# Altium project smoothieboard-alt.PrjPcb (part 1 of 4)
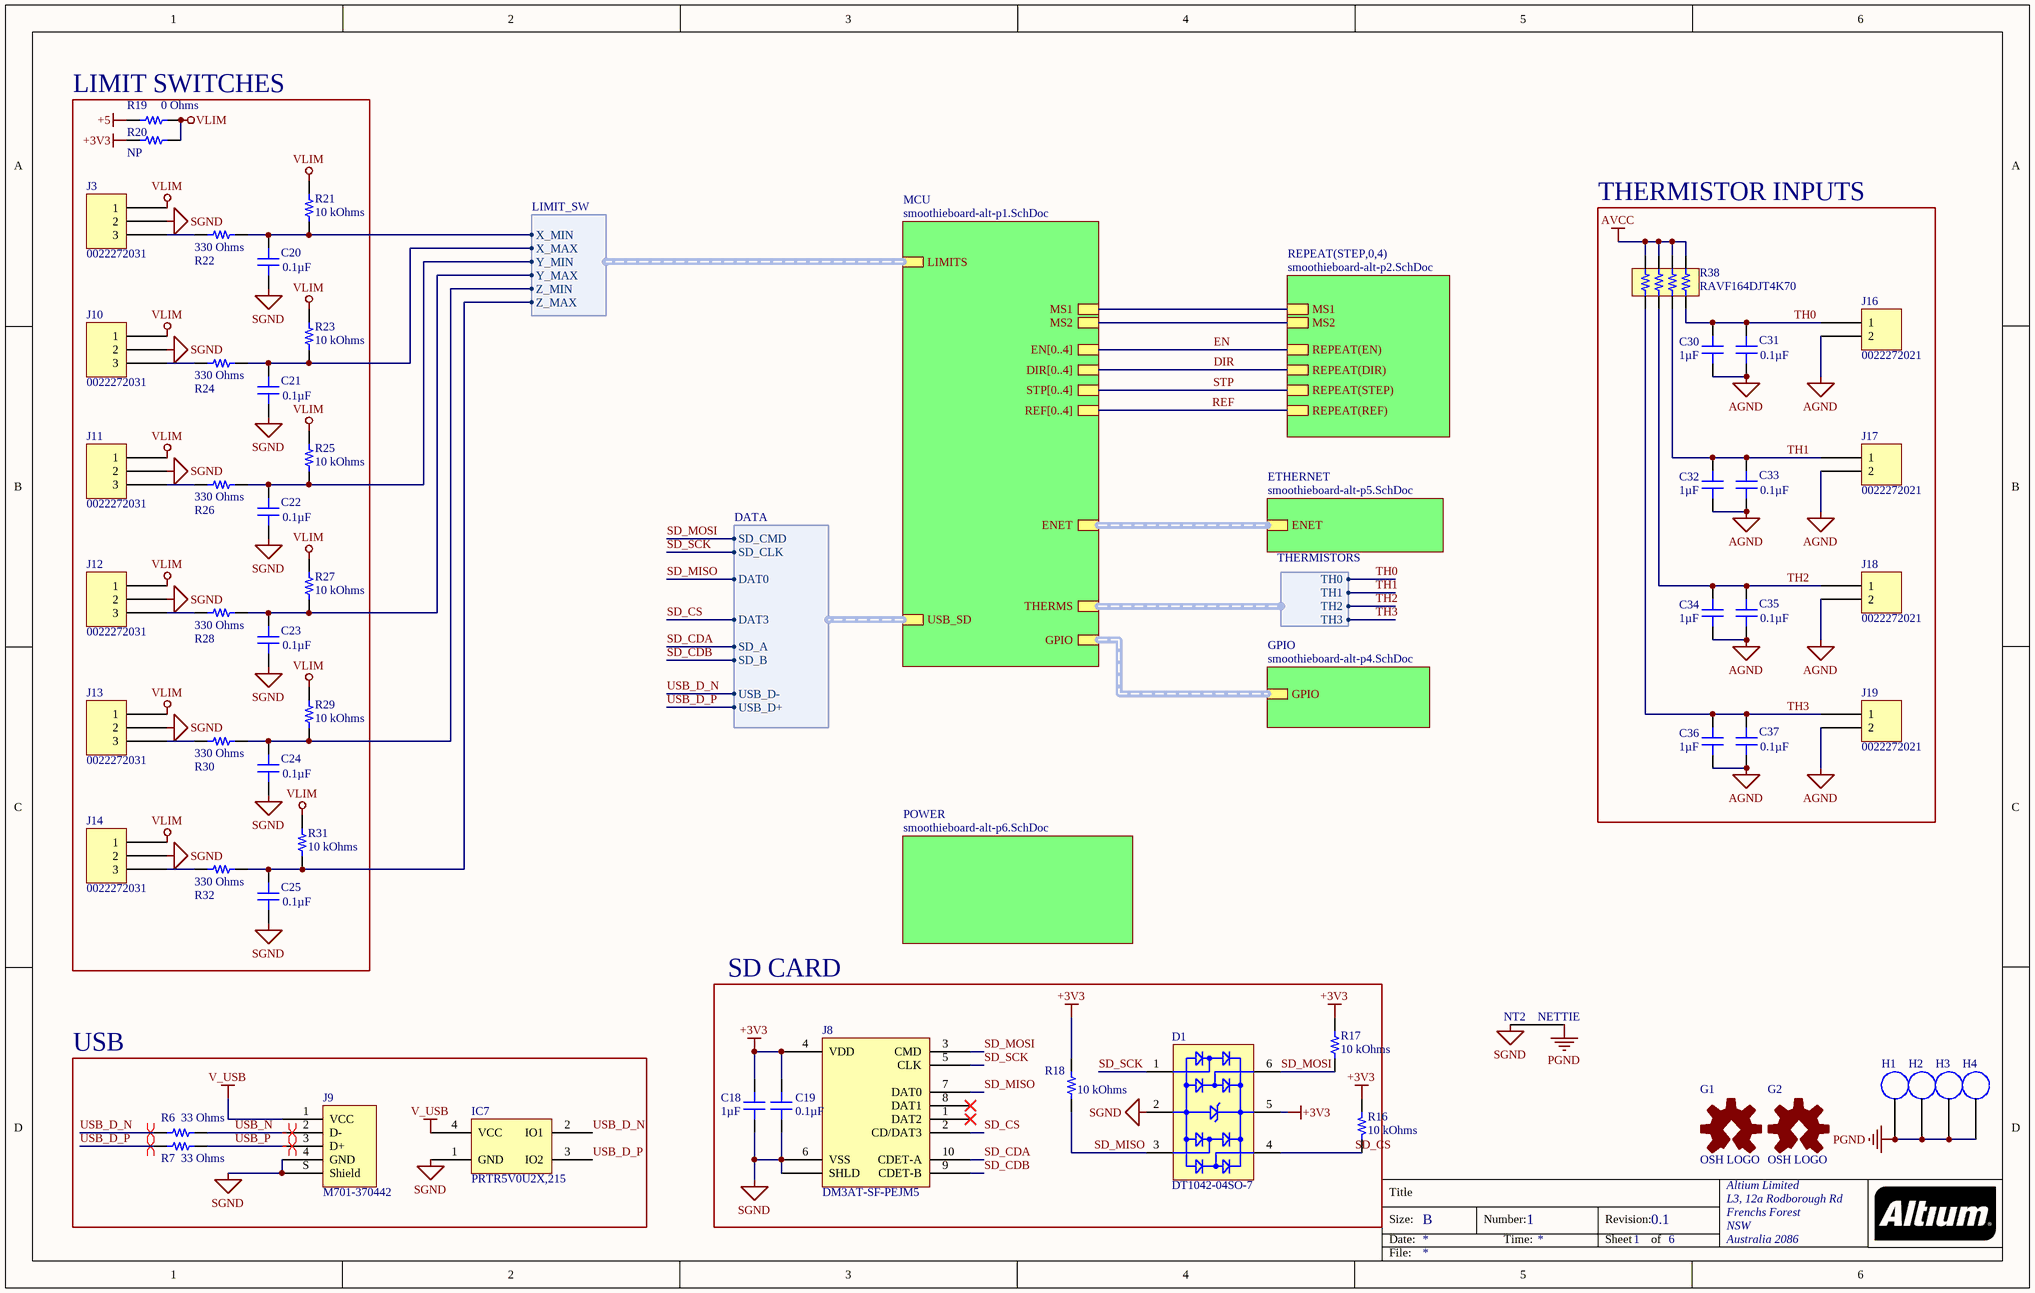
[diagram p0: smoothieboard-alt-p0.SchDoc]
ProjectTitle: SmoothieBoard-alt
7 sheets, 360 parts. Net scope: hierarchical (ports join the sheet entries above them; power ports are global).
Board file: smoothieboard-alt.PcbDoc
Sheets:
  smoothieboard-alt-p0.SchDoc
    MCU = smoothieboard-alt-p1.SchDoc
      DIGI POTS = smoothieboard-alt-p3.SchDoc
    GPIO = smoothieboard-alt-p4.SchDoc
    ETHERNET = smoothieboard-alt-p5.SchDoc
    POWER = smoothieboard-alt-p6.SchDoc
    STEP0 = smoothieboard-alt-p2.SchDoc
    STEP1 = smoothieboard-alt-p2.SchDoc
    STEP2 = smoothieboard-alt-p2.SchDoc
    STEP3 = smoothieboard-alt-p2.SchDoc
    STEP4 = smoothieboard-alt-p2.SchDoc

## Sheet smoothieboard-alt-p0.SchDoc: =ProjectTitle
size B; Organization: Altium Limited; Address1: L3, 12a Rodborough Rd; Address2: Frenchs Forest; Address3: NSW; Address4: Australia 2086; DocumentNumber: 1; Revision: 0.1; SheetNumber: 1; SheetTotal: 6

### Parts
C18  1µF  [CAP 0603_1608]
C19  0.1µF  [CAP 0402_1005]
C20  0.1µF  [CAP 0402_1005]
C21  0.1µF  [CAP 0402_1005]
C22  0.1µF  [CAP 0402_1005]
C23  0.1µF  [CAP 0402_1005]
C24  0.1µF  [CAP 0402_1005]
C25  0.1µF  [CAP 0402_1005]
C30  1µF  [CAP 0603_1608]
C31  0.1µF  [CAP 0402_1005]
C32  1µF  [CAP 0603_1608]
C33  0.1µF  [CAP 0402_1005]
C34  1µF  [CAP 0603_1608]
C35  0.1µF  [CAP 0402_1005]
C36  1µF  [CAP 0603_1608]
C37  0.1µF  [CAP 0402_1005]
D1  DT1042-04SO-7  [DIODES SOT-23-6 W6]
G1  OSH LOGO  [OSH_LOGO]  (no BOM)
G2  OSH LOGO  [OSH_LOGO]  (no BOM)
H1  PTH  [PTH-M3.5]  (value not drawn)  (no BOM)
H2  PTH  [PTH-M3.5]  (value not drawn)  (no BOM)
H3  PTH  [PTH-M3.5]  (value not drawn)  (no BOM)
H4  PTH  [PTH-M3.5]  (value not drawn)  (no BOM)
IC7  PRTR5V0U2X,215  [SOT143B]
J3  0022272031  [MOLEX KK 0022272031]
J8  DM3AT-SF-PEJM5  [HIROSE DM3AT-SF-PEJM5]
J9  M701-370442  [HARWIN USB M701-370442]
J10  0022272031  [MOLEX KK 0022272031]
J11  0022272031  [MOLEX KK 0022272031]
J12  0022272031  [MOLEX KK 0022272031]
J13  0022272031  [MOLEX KK 0022272031]
J14  0022272031  [MOLEX KK 0022272031]
J16  0022272021  [MOLEX KK 0022272021]
J17  0022272021  [MOLEX KK 0022272021]
J18  0022272021  [MOLEX KK 0022272021]
J19  0022272021  [MOLEX KK 0022272021]
NT2  NETTIE  [NETTIE]  (net tie, no BOM)
R6  33 Ohms  [RES 0402_1005]
R7  33 Ohms  [RES 0402_1005]
R16  10 kOhms  [RES 0402_1005]
R17  10 kOhms  [RES 0402_1005]
R18  10 kOhms  [RES 0402_1005]
R19  0 Ohms  [RES 0603_1608]
R20  NP  [RES 0603_1608]
R21  10 kOhms  [RES 0603_1608]
R22  330 Ohms  [RES 0603_1608]
R23  10 kOhms  [RES 0603_1608]
R24  330 Ohms  [RES 0603_1608]
R25  10 kOhms  [RES 0603_1608]
R26  330 Ohms  [RES 0603_1608]
R27  10 kOhms  [RES 0603_1608]
R28  330 Ohms  [RES 0603_1608]
R29  10 kOhms  [RES 0603_1608]
R30  330 Ohms  [RES 0603_1608]
R31  10 kOhms  [RES 0603_1608]
R32  330 Ohms  [RES 0603_1608]
R38  RAVF164DJT4K70  [RESNET 1206-8 CONVEX]

### Blocks framed on the sheet
LIMIT SWITCHES: C20-C25 J3 J10-J14 R19-R32
THERMISTOR INPUTS: C30-C37 J16-J19 R38
SD CARD: C18 C19 D1 J8 R16-R18
USB: IC7 J9 R6 R7

### Sub-sheets
ETHERNET = smoothieboard-alt-p5.SchDoc: ENET (harness ENET)
GPIO = smoothieboard-alt-p4.SchDoc: GPIO
MCU = smoothieboard-alt-p1.SchDoc: LIMITS (harness LIMIT_SW), USB_SD (harness DATA), THERMS (harness THERMISTORS), GPIO (harness GPIO), ENET (harness ENET), EN[0..4], DIR[0..4], STP[0..4], REF[0..4], MS1, MS2
POWER = smoothieboard-alt-p6.SchDoc: no entries
REPEAT(STEP,0,4) = smoothieboard-alt-p2.SchDoc: REPEAT(DIR), REPEAT(EN), REPEAT(STEP), REPEAT(REF), MS1, MS2

### Harnesses
DATA: SD_CMD, SD_CLK, DAT0, DAT3, SD_A, SD_B, USB_D-, USB_D+
LIMIT_SW: X_MIN, X_MAX, Y_MIN, Y_MAX, Z_MIN, Z_MAX
THERMISTORS: TH0, TH1, TH2, TH3

### Nets
+3V3: C18.2 C19.2 D1.5(VBUS) J8.4(VDD) R16.1 R17.1 R18.1 R20.1
+5: R19.1
AGND: C30.1 C31.1 C32.1 C33.1 C34.1 C35.1 C36.1 C37.1 J16.2 J17.2 J18.2 J19.2
AVCC: R38.5 R38.6 R38.7 R38.8
PGND: H1.1 H2.1 H3.1 H4.1 NT2.2
SGND: C18.1 C19.1 C20.1 C21.1 C22.1 C23.1 C24.1 C25.1 D1.2(GND) IC7.1(GND) J3.2 J8.6(VSS) J8.S(SHLD) J9.4(GND) J9.S(Shield) J10.2 J11.2 J12.2 J13.2 J14.2 NT2.1
V_USB: IC7.4(VCC) J9.1(VCC)
VLIM: J3.1 J10.1 J11.1 J12.1 J13.1 J14.1 R19.2 R20.2 R21.1 R23.1 R25.1 R27.1 R29.1 R31.1
DIR: sheet REPEAT(STEP,0,4)/REPEAT(DIR)
EN: sheet REPEAT(STEP,0,4)/REPEAT(EN)
MS1: sheet MCU/MS1, sheet REPEAT(STEP,0,4)/MS1
MS2: sheet MCU/MS2, sheet REPEAT(STEP,0,4)/MS2
REF: sheet REPEAT(STEP,0,4)/REPEAT(REF)
SD_CDA: J8.10(CDET-A) ; sheet MCU/USB_SD.SD_A
SD_CDB: J8.9(CDET-B) ; sheet MCU/USB_SD.SD_B
SD_CS: D1.4(I/O_3) J8.2(CD/DAT3) R16.2 ; sheet MCU/USB_SD.DAT3
SD_MISO: D1.3(I/O_2) J8.7(DAT0) R18.2 ; sheet MCU/USB_SD.DAT0
SD_MOSI: D1.6(I/O_4) J8.3(CMD) R17.2 ; sheet MCU/USB_SD.SD_CMD
SD_SCK: D1.1(I/O_1) J8.5(CLK) ; sheet MCU/USB_SD.SD_CLK
STP: sheet REPEAT(STEP,0,4)/REPEAT(STEP)
TH0: C30.2 C31.2 J16.1 R38.4 ; sheet MCU/THERMS.TH0
TH1: C32.2 C33.2 J17.1 R38.3 ; sheet MCU/THERMS.TH1
TH2: C34.2 C35.2 J18.1 R38.2 ; sheet MCU/THERMS.TH2
TH3: C36.2 C37.2 J19.1 R38.1 ; sheet MCU/THERMS.TH3
USB_D_N: IC7.2(IO1) R6.1 ; sheet MCU/USB_SD.USB_D-
USB_D_P: IC7.3(IO2) R7.1 ; sheet MCU/USB_SD.USB_D+
USB_N: J9.2(D-) R6.2
USB_P: J9.3(D+) R7.2
NetC20_2: C20.2 R21.2 R22.1 ; sheet MCU/LIMITS.X_MIN
NetC21_2: C21.2 R23.2 R24.1 ; sheet MCU/LIMITS.X_MAX
NetC22_2: C22.2 R25.2 R26.1 ; sheet MCU/LIMITS.Y_MIN
NetC23_2: C23.2 R27.2 R28.1 ; sheet MCU/LIMITS.Y_MAX
NetC24_2: C24.2 R29.2 R30.1 ; sheet MCU/LIMITS.Z_MIN
NetC25_2: C25.2 R31.2 R32.1 ; sheet MCU/LIMITS.Z_MAX
NetJ3_3: J3.3 R22.2
NetJ10_3: J10.3 R24.2
NetJ11_3: J11.3 R26.2
NetJ12_3: J12.3 R28.2
NetJ13_3: J13.3 R30.2
NetJ14_3: J14.3 R32.2

Not connected (* = marked no-connect by the designer): J8 1(DAT2)* 8(DAT1)*

### Buses and harness runs
harness sheet ETHERNET/ENET = sheet MCU/ENET
harness sheet GPIO/GPIO = sheet MCU/GPIO

### Layout directives
differential pair: USB_D_N, USB_D_P, USB_N, USB_P

### Notes on the sheet
- Title
- Size:
- Date:
- B
- Number:
- Time:
- Revision:
- Sheet
- of
- File:

### Library data of the parts
C18 C30 C32 C34 C36 = CL10B105KQ8NNNC: CAP CER 1UF 6.3V X7R 0603; Manufacturer: Samsung Electro-Mechanics; Tolerance: ±10%; Part Number: CL10B105KQ8NNNC; Value: 1µF; Applications: General Purpose; Capacitance: 1µF; ComponentLink1Description: Datasheet; ComponentLink1URL: http://www.samsungsem.com/kr/support/product-search/mlcc/CL10B105KQ8NNNC.jsp; ComponentLink2Description: DigiKey Link; ComponentLink2URL: http://digikey.com/product-detail/en/samsung-electro-mechanics/CL10B105KQ8NNNC/1276-1024-1-ND/3889110; Device Package: 0603 (1608 Metric); LastUpdated: 9/2/2020 01:03:22; Lifecycle Status: Active; Minimum Order: 1; Mounting Type: Surface Mount, MLCC; Operating Temperature: -55°C ~ 125°C; Package / Case: 0603 (1608 Metric); Packaging: TapeAndReel; PartId: 9830; Part Status: Active; Price: 0.01; Series: CL; Size / Dimension: 0.063" L x 0.031" W (1.60mm x 0.80mm); Supplier 1: DigiKey; Supplier Part Number 1: 1276-1024-1-ND; Temperature Coefficient: X7R; Thickness (Max): 0.035" (0.90mm); Voltage - Rated: 6.3V
C19-C25 C31 C33 C35 C37 = CC0402MRX5R5BB104: CAP CER 0.1UF 6.3V X5R 0402; Manufacturer: Yageo; Tolerance: ±20%; Part Number: CC0402MRX5R5BB104; Value: 0.1µF; Applications: General Purpose; Capacitance: 0.1µF; ComponentLink1Description: Datasheet; ComponentLink1URL: https://www.yageo.com/upload/media/product/productsearch/datasheet/mlcc/UPY-GPHC_X5R_4V-to-50V_25.pdf; ComponentLink2Description: DigiKey Link; ComponentLink2URL: http://digikey.com/product-detail/en/yageo/CC0402MRX5R5BB104/311-3818-1-ND/8024907; Device Package: 0402 (1005 Metric); LastUpdated: 9/2/2020 01:02:24; Lifecycle Status: Active; Minimum Order: 1; Mounting Type: Surface Mount, MLCC; Operating Temperature: -55°C ~ 85°C; Package / Case: 0402 (1005 Metric); Packaging: CutTape; PartId: 1960; Part Status: Active; Price: 0.10; Series: CC; Size / Dimension: 0.039" L x 0.020" W (1.00mm x 0.50mm); Supplier 1: DigiKey; Supplier Part Number 1: 311-3818-1-ND; Temperature Coefficient: X5R; Thickness (Max): 0.022" (0.55mm); Voltage - Rated: 6.3V
D1 = DT1042-04SO-7: TVS DIODE 5V 9V SOT26; Manufacturer: Diodes Incorporated; Current - Peak Pulse (10/1000µs): 6A (8/20µs); Power Line Protection: Yes; Power - Peak Pulse: 55W; Type: Steering (Rail to Rail); Unidirectional Channels: 4; Voltage - Breakdown (Min): 6.2V; Voltage - Reverse Standoff (Typ): 5V (Max); Part Number: DT1042-04SO-7; Applications: HDMI; ComponentLink1Description: Datasheet; ComponentLink1URL: https://www.diodes.com/assets/Datasheets/DT1042-04SO.pdf; ComponentLink2Description: DigiKey Link; ComponentLink2URL: http://digikey.com/product-detail/en/diodes-incorporated/DT1042-04SO-7/DT1042-04SO-7DICT-ND/4457893; Device Package: SOT-23-6; LastUpdated: 3/30/2020 16:25:53; Lifecycle Status: Active; Minimum Order: 1; Mounting Type: Surface Mount; Operating Temperature: -55°C ~ 85°C (TA); Package / Case: SOT-23-6; Packaging: TapeAndReel; PartId: 10505; Part Status: Active; Price: 0.08; Series: -; Supplier 1: DigiKey; Supplier Part Number 1: DT1042-04SO-7DICT-ND; Supplier Device Package: SOT-26; Voltage - Clamping (Max) @ Ipp: 9V
G1 G2 = OSH_LOGO: Open source hardware logo
H1-H4 = PTH: Plated thru-hole.
IC7 = PRTR5V0U2X,215: TVS DIODE 5.5V SOT143B; Manufacturer: Nexperia USA Inc.; Capacitance @ Frequency: 1pF @ 1MHz; Power Line Protection: Yes; Unidirectional Channels: 2; Voltage - Breakdown (Min): 6V; Voltage - Reverse Standoff (Typ): 5.5V (Max); Part Number: PRTR5V0U2X,215; Applications: General Purpose; ComponentLink1Description: Datasheet; ComponentLink1URL: https://assets.nexperia.com/documents/data-sheet/PRTR5V0U2X.pdf; ComponentLink2Description: DigiKey Link; ComponentLink2URL: //digikey.com/product-detail/en/nexperia-usa-inc/PRTR5V0U2X215/1727-3884-2-ND/1163690; Device Package: TO-253-4, TO-253AA; LastUpdated: 12/9/2019 21:29:05; Lifecycle Status: 0; Minimum Order: 1; Mounting Type: Surface Mount; Operating Temperature: -40°C ~ 85°C (TA); Package / Case: TO-253-4, TO-253AA; Packaging: TapeAndReel; PartId: 5451; Part Status: Active; Price: 0.18; Series: -; Supplier 1: DigiKey; Supplier Part Number 1: 1727-3884-2-ND; Supplier Device Package: SOT-143B; Type: Steering (Rail to Rail)
J3 J10-J14 = 0022272031: CONN HEADER VERT 3POS 2.54MM; Manufacturer: Molex; Contact Length - Mating: 0.295" (7.49mm); Contact Length - Post: 0.140" (3.56mm); Material Flammability Rating: UL94 V-0; Number of Positions: 3; Number of Positions Loaded: All; Overall Contact Length: 0.560" (14.22mm); Pitch - Mating: 0.100" (2.54mm); Shrouding: Shrouded - 1 Wall; Style: Board to Cable/Wire; Part Number: 0022272031; ComponentLink1Description: Datasheet; ComponentLink1URL: https://www.molex.com/pdm_docs/sd/022272031_sd.pdf; ComponentLink2Description: DigiKey Link; ComponentLink2URL: http://digikey.com/product-detail/en/molex/0022272031/WM4112-ND/1130578; Connector Type: Header; Contact Finish - Mating: Tin; Contact Finish - Post: Tin; Contact Finish Thickness - Mating: 100.0µin (2.54µm); Contact Material: Brass; Contact Shape: Square; Contact Type: Male Pin; Fastening Type: Friction Lock; Insulation Color: Natural; Insulation Height: 0.461" (11.70mm); Insulation Material: Polyamide (PA), Nylon; LastUpdated: 1/12/2020 23:51:54; Lifecycle Status: Active; Minimum Order: 1; Mounting Type: Through Hole; Number of Rows: 1; Packaging: Bulk; PartId: 77; Part Status: Active; Price: 0.37; Series: KK 6410; Supplier 1: DigiKey; Supplier Part Number 1: WM4112-ND; Termination: Solder
J8 = DM3AT-SF-PEJM5: CONN MICRO SD CARD PUSH-PUSH R/A; Manufacturer: Hirose Electric Co Ltd; Card Type: Secure Digital - microSD™; Connector Type: Connector and Ejector; Insertion, Removal Method: Push In, Push Out; Number of Positions: 10 (8 + 2); Part Number: DM3AT-SF-PEJM5; ComponentLink1Description: Datasheet; ComponentLink1URL: https://www.hirose.com/product/document?clcode=CL0609-0033-6-00&productname=DM3AT-SF-PEJ2M5&series=DM3&documenttype=Catalog&lang=en&documentid=D49662_en; ComponentLink2Description: DigiKey Link; ComponentLink2URL: //digikey.com/product-detail/en/hirose-electric-co-ltd/DM3AT-SF-PEJM5/HR1964TR-ND/2533565; Contact Finish: Gold; Features: Switch; Height Above Board: 0.066" (1.68mm); LastUpdated: 12/16/2019 20:34:40; Lifecycle Status: 0; Minimum Order: 1; Mounting Feature: Normal, Standard - Top; Mounting Type: Surface Mount, Right Angle; Packaging: TapeAndReel; Part Status: Active; Price: 1.41; Series: DM3; Supplier 1: DigiKey; Supplier Part Number 1: HR1964TR-ND
J9 = M701-370442: CONN RCPT USB2.0 TYPEB 4P SMD RA; Manufacturer: Harwin Inc.; Connector Type: USB - B; Current Rating (Amps): 1.5A; Gender: Receptacle; Mating Cycles: 1500; Number of Contacts: 4; Number of Ports: 1; Shielding: Unshielded; Voltage - Rated: 250VAC; Part Number: M701-370442; ComponentLink1Description: Datasheet; ComponentLink1URL: https://cdn.harwin.com/pdfs/M701-370442.pdf; ComponentLink2Description: DigiKey Link; ComponentLink2URL: //digikey.com/product-detail/en/harwin-inc/M701-370442/952-1768-ND/3727737; Features: Board Guide, Solder Retention; LastUpdated: 12/9/2019 20:50:51; Lifecycle Status: 0; Minimum Order: 1; Mounting Feature: Horizontal; Mounting Type: Surface Mount, Right Angle; Packaging: Bulk; Part Status: Active; Price: 1.36; Series: -; Specifications: USB 2.0; Supplier 1: DigiKey; Supplier Part Number 1: 952-1768-ND; Termination: Solder
J16-J19 = 0022272021: CONN HEADER VERT 2POS 2.54MM; Manufacturer: Molex; Contact Length - Mating: 0.295" (7.49mm); Contact Length - Post: 0.140" (3.56mm); Material Flammability Rating: UL94 V-0; Number of Positions: 2; Number of Positions Loaded: All; Overall Contact Length: 0.560" (14.22mm); Pitch - Mating: 0.100" (2.54mm); Shrouding: Shrouded - 1 Wall; Style: Board to Cable/Wire; Part Number: 0022272021; ComponentLink1Description: Datasheet; ComponentLink1URL: https://www.molex.com/pdm_docs/sd/022272021_sd.pdf; ComponentLink2Description: DigiKey Link; ComponentLink2URL: http://digikey.com/product-detail/en/molex/0022272021/WM4111-ND/1130577; Connector Type: Header; Contact Finish - Mating: Tin; Contact Finish - Post: Tin; Contact Finish Thickness - Mating: 100.0µin (2.54µm); Contact Material: Brass; Contact Shape: Square; Contact Type: Male Pin; Fastening Type: Friction Lock; Insulation Color: Natural; Insulation Height: 0.461" (11.70mm); Insulation Material: Polyamide (PA), Nylon; LastUpdated: 1/12/2020 23:51:43; Lifecycle Status: Active; Minimum Order: 1; Mounting Type: Through Hole; Number of Rows: 1; Packaging: Bulk; PartId: 76; Part Status: Active; Price: 0.27; Series: KK 6410; Supplier 1: DigiKey; Supplier Part Number 1: WM4111-ND; Termination: Solder
NT2 = NETTIE: Net tie point.
R6 R7 = SFR01MZPF33R0: RES 33 OHM 1% 1/16W 0402; Manufacturer: Rohm Semiconductor; Power (Watts): 0.063W, 1/16W; Temperature Coefficient: ±100ppm/°C; Part Number: SFR01MZPF33R0; Value: 33 Ohms; ComponentLink1Description: Datasheet; ComponentLink1URL: https://www.rohm.com/datasheet/SFR01MZPF/sfr-e; ComponentLink2Description: DigiKey Link; ComponentLink2URL: http://digikey.com/product-detail/en/rohm-semiconductor/SFR01MZPF33R0/511-1806-1-ND/9771870; Composition: Thick Film; Device Package: 0402 (1005 Metric); Features: Anti-Sulfur; Height - Seated (Max): 0.016" (0.40mm); LastUpdated: 9/2/2020 01:07:51; Lifecycle Status: Active; Minimum Order: 1; Number of Terminations: 2; Operating Temperature: -55°C ~ 155°C; Package / Case: 0402 (1005 Metric); Packaging: TapeAndReel; PartId: 11505; Part Status: Active; Price: 0.01; Resistance: 33 Ohms; Series: SFR; Size / Dimension: 0.039" L x 0.020" W (1.00mm x 0.50mm); Supplier 1: DigiKey; Supplier Part Number 1: 511-1806-1-ND; Supplier Device Package: 0402; Tolerance: ±1%
R16-R18 = CRCW040210K0JNTD: RES SMD 10K OHM 5% 1/16W 0402; Manufacturer: Vishay Dale; Power (Watts): 0.063W, 1/16W; Temperature Coefficient: ±200ppm/°C; Part Number: CRCW040210K0JNTD; Value: 10 kOhms; ComponentLink1Description: Datasheet; ComponentLink1URL: http://www.vishay.com/docs/20008/dcrcw.pdf; ComponentLink2Description: DigiKey Link; ComponentLink2URL: http://digikey.com/product-detail/en/vishay-dale/CRCW040210K0JNTD/541-CRCW040210K0JNTDCT-ND/11501263; Composition: Thick Film; Device Package: 0402 (1005 Metric); Features: Automotive AEC-Q200; LastUpdated: 9/2/2020 01:07:22; Lifecycle Status: Active; Minimum Order: 1; Number of Terminations: 2; Operating Temperature: -55°C ~ 155°C; Package / Case: 0402 (1005 Metric); Packaging: TapeAndReel; PartId: 56880; Price: 0.01; Ratings: AEC-Q200; Resistance: 10 kOhms; Series: CRCW; Supplier 1: DigiKey; Supplier Part Number 1: 541-CRCW040210K0JNTDCT-ND; Supplier Device Package: 0402; Tolerance: ±5%
R19 = CRCW06030000Z0EAHP: RES SMD 0 OHM JUMPER 1/4W 0603; Manufacturer: Vishay Dale; Power (Watts): 0.25W, 1/4W; Part Number: CRCW06030000Z0EAHP; Value: 0 Ohms; ComponentLink1Description: Datasheet; ComponentLink1URL: http://www.vishay.com/docs/20043/crcwhpe3.pdf; ComponentLink2Description: DigiKey Link; ComponentLink2URL: http://digikey.com/product-detail/en/vishay-dale/CRCW06030000Z0EAHP/541-0.0SBCT-ND/2222749; Composition: Thick Film; Device Package: 0603 (1608 Metric); Features: Automotive AEC-Q200, Pulse Withstanding; Height - Seated (Max): 0.022" (0.55mm); LastUpdated: 9/2/2020 01:10:23; Lifecycle Status: Active; Minimum Order: 1; Number of Terminations: 2; Operating Temperature: -55°C ~ 155°C; Package / Case: 0603 (1608 Metric); Packaging: TapeAndReel; PartId: 5474; Part Status: Active; Price: 0.02; Ratings: AEC-Q200; Resistance: 0 Ohms; Series: CRCW-HP; Size / Dimension: 0.063" L x 0.033" W (1.60mm x 0.85mm); Supplier 1: DigiKey; Supplier Part Number 1: 541-0.0SBCT-ND; Supplier Device Package: 0603; Tolerance: Jumper
R20 = CRCW06030000Z0EAHP: RES SMD 0 OHM JUMPER 1/4W 0603; Manufacturer: Vishay Dale; Power (Watts): 0.25W, 1/4W; Resistance: 0 Ohms; Part Number: CRCW06030000Z0EAHP; Value: NP; ComponentLink1Description: Datasheet; ComponentLink1URL: http://www.vishay.com/docs/20043/crcwhpe3.pdf; ComponentLink2Description: DigiKey Link; ComponentLink2URL: http://digikey.com/product-detail/en/vishay-dale/CRCW06030000Z0EAHP/541-0.0SBCT-ND/2222749; Composition: Thick Film; Device Package: 0603 (1608 Metric); Features: Automotive AEC-Q200, Pulse Withstanding; Height - Seated (Max): 0.022" (0.55mm); LastUpdated: 9/2/2020 01:10:23; Lifecycle Status: Active; Minimum Order: 1; Number of Terminations: 2; Operating Temperature: -55°C ~ 155°C; Package / Case: 0603 (1608 Metric); Packaging: TapeAndReel; PartId: 5474; Part Status: Active; Price: 0.02; Ratings: AEC-Q200; Series: CRCW-HP; Size / Dimension: 0.063" L x 0.033" W (1.60mm x 0.85mm); Supplier 1: DigiKey; Supplier Part Number 1: 541-0.0SBCT-ND; Supplier Device Package: 0603; Tolerance: Jumper
R21 R23 R25 R27 R29 R31 = RCS060310K0JNEA: RES SMD 10K OHM 5% 1/4W 0603; Manufacturer: Vishay Dale; Power (Watts): 0.25W, 1/4W; Temperature Coefficient: ±200ppm/°C; Part Number: RCS060310K0JNEA; Value: 10 kOhms; ComponentLink1Description: Datasheet; ComponentLink1URL: http://www.vishay.com/docs/20065/rcse3.pdf; ComponentLink2Description: DigiKey Link; ComponentLink2URL: http://digikey.com/product-detail/en/vishay-dale/RCS060310K0JNEA/541-2817-1-ND/5867110; Composition: Thick Film; Device Package: 0603 (1608 Metric); Features: Automotive AEC-Q200, Pulse Withstanding; Height - Seated (Max): 0.020" (0.50mm); LastUpdated: 9/2/2020 01:10:24; Lifecycle Status: Active; Minimum Order: 1; Number of Terminations: 2; Operating Temperature: -55°C ~ 155°C; Package / Case: 0603 (1608 Metric); Packaging: TapeAndReel; PartId: 5383; Part Status: Active; Price: 0.02; Ratings: AEC-Q200; Resistance: 10 kOhms; Series: RCS e3; Size / Dimension: 0.061" L x 0.033" W (1.55mm x 0.85mm); Supplier 1: DigiKey; Supplier Part Number 1: 541-2817-1-ND; Supplier Device Package: 0603; Tolerance: ±5%
R22 R24 R26 R28 R30 R32 = ERJ-3GEYJ331V: RES SMD 330 OHM 5% 1/10W 0603; Manufacturer: Panasonic Electronic Components; Power (Watts): 0.1W, 1/10W; Temperature Coefficient: ±200ppm/°C; Part Number: ERJ-3GEYJ331V; Value: 330 Ohms; ComponentLink1Description: Datasheet; ComponentLink1URL: http://industrial.panasonic.com/www-cgi/jvcr13pz.cgi?E+PZ+3+AOA0001+ERJ3GEYJ331V+7+WW; ComponentLink2Description: DigiKey Link; ComponentLink2URL: http://digikey.com/product-detail/en/panasonic-electronic-components/ERJ-3GEYJ331V/P330GCT-ND/134778; Composition: Thick Film; Device Package: 0603 (1608 Metric); Features: Automotive AEC-Q200; Height - Seated (Max): 0.022" (0.55mm); LastUpdated: 9/2/2020 01:10:18; Lifecycle Status: Active; Minimum Order: 1; Number of Terminations: 2; Operating Temperature: -55°C ~ 155°C; Package / Case: 0603 (1608 Metric); Packaging: TapeAndReel; PartId: 8114; Part Status: Active; Price: 0.01; Ratings: AEC-Q200; Resistance: 330 Ohms; Series: ERJ; Size / Dimension: 0.063" L x 0.031" W (1.60mm x 0.80mm); Supplier 1: DigiKey; Supplier Part Number 1: P330GCT-ND; Supplier Device Package: 0603; Tolerance: ±5%
R38 = RAVF164DJT4K70: RES ARRAY 4 RES 4.7K OHM 1206; Manufacturer: Stackpole Electronics Inc; Circuit Type: Isolated; Number of Resistors: 4; Power Per Element: 62.5mW; Temperature Coefficient: ±200ppm/°C; Tolerance: ±5%; Part Number: RAVF164DJT4K70; Applications: Automotive AEC-Q200; ComponentLink1Description: Datasheet; ComponentLink1URL: https://www.seielect.com/catalog/sei-ravf.pdf; ComponentLink2Description: DigiKey Link; ComponentLink2URL: http://digikey.com/product-detail/en/stackpole-electronics-inc/RAVF164DJT4K70/RAVF164DJT4K70CT-ND/2425255; Height - Seated (Max): 0.024" (0.60mm); LastUpdated: 9/2/2020 01:23:25; Lifecycle Status: Active; Minimum Order: 1; Mounting Type: Surface Mount; Number of Pins: 8; Operating Temperature: -55°C ~ 155°C; Package / Case: 1206 (3216 Metric), Convex, Long Side Terminals; Packaging: TapeAndReel; PartId: 53; Part Status: Active; Price: 0.01; Resistance (Ohms): 4.7k; Series: RAVF; Size / Dimension: 0.126" L x 0.063" W (3.20mm x 1.60mm); Supplier 1: DigiKey; Supplier Part Number 1: RAVF164DJT4K70CT-ND